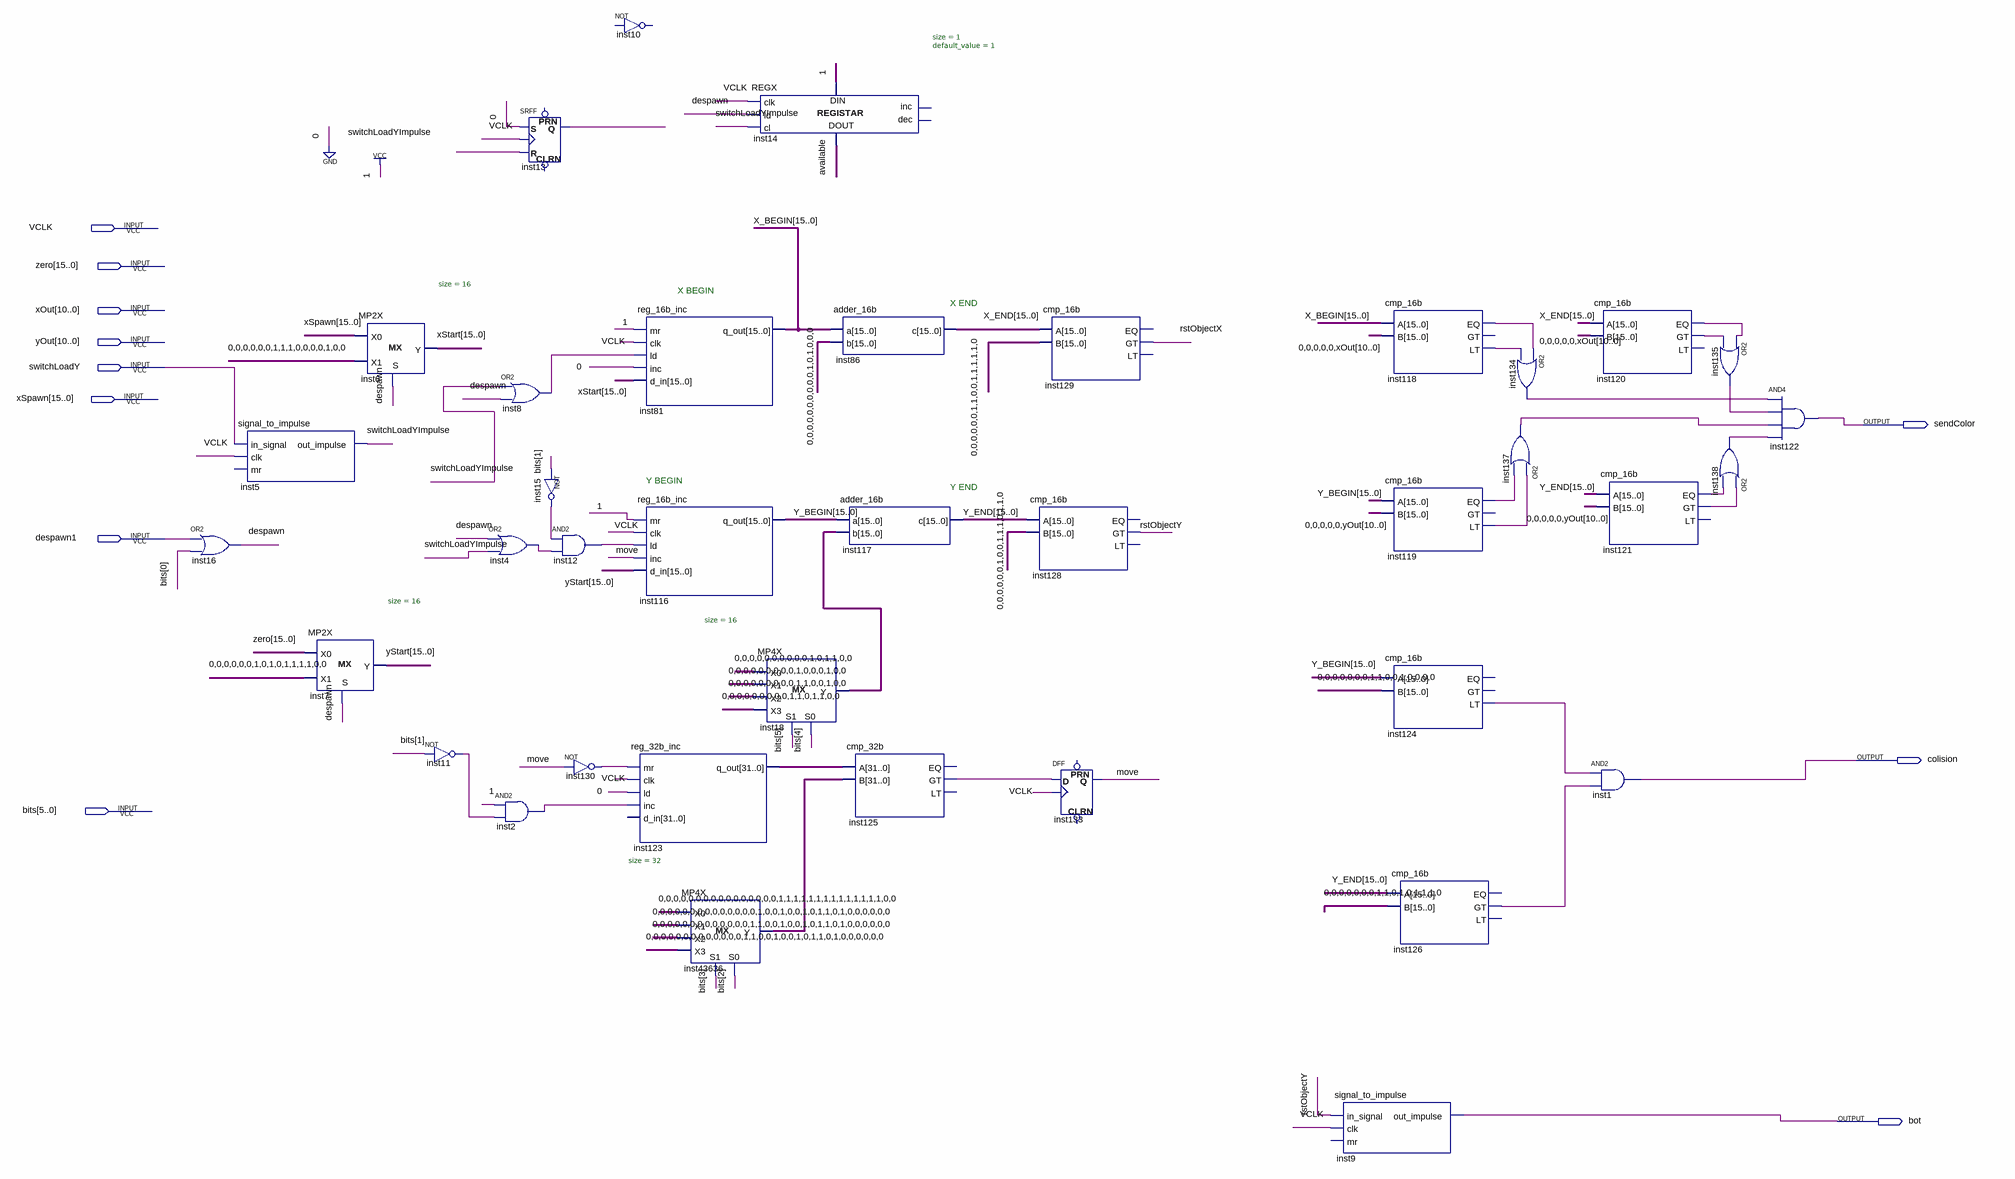
[diagram p0: schematic sheet]
// Quartus schematic object.bdf as structural Verilog: 38 symbols, 11 pins
module object (
  input  VCLK,
  input  [15:0] zero,
  input  [10:0] xOut,
  input  [10:0] yOut,
  input  switchLoadY,
  input  [15:0] xSpawn,
  input  despawn1,
  input  [5:0] bits,
  output sendColor,
  output colision,
  output bot
);

  wire available, despawn, inst2_out, inst4_out, inst8_out, inst11_out, inst12_out, inst13_q, inst15_out,
       inst118_eq, inst118_lt, inst119_eq, inst119_lt, inst120_eq, inst120_gt, inst121_eq, inst121_gt,
       inst124_lt, inst125_gt, inst126_gt, inst130_out, inst134_out, inst135_out, inst137_out, inst138_out,
       move, rstObjectX, rstObjectY, switchLoadYImpulse;
  wire [15:0] inst18_y, X_BEGIN, X_END, xStart, Y_BEGIN, Y_END, yStart;
  wire [31:0] inst123_q_out, inst43636_y;

  or inst16 (despawn, despawn1, bits[0]);
  signal_to_impulse inst5 (.in_signal(switchLoadY), .clk(VCLK), .out_impulse(switchLoadYImpulse));  // open: mr
  MP2X #(.size(16)) inst7 (.S(despawn), .X0(zero), .X1(16'b0000001010111100), .Y(yStart));
  MP2X #(.size(16)) inst6 (.S(despawn), .X0(xSpawn), .X1(16'b0000001110000100), .Y(xStart));
  not inst11 (inst11_out, bits[1]);
  or inst8 (inst8_out, switchLoadYImpulse, despawn);
  or inst4 (inst4_out, despawn, switchLoadYImpulse);
  and inst2 (inst2_out, 1'b1, inst11_out);
  SRFF inst13 (.S(1'b0), .R(switchLoadYImpulse), .CLK(VCLK), .Q(inst13_q));  // open: PRN, CLRN
  not inst15 (inst15_out, bits[1]);
  and inst12 (inst12_out, inst15_out, inst4_out);
  not inst130 (inst130_out, move);
  // NOT inst10 is placed but not wired
  reg_16b_inc inst81 (.mr(1'b1), .clk(VCLK), .ld(inst8_out), .inc(1'b0), .d_in(xStart), .q_out(X_BEGIN));
  reg_16b_inc inst116 (.mr(1'b1), .clk(VCLK), .ld(inst12_out), .inc(move), .d_in(yStart), .q_out(Y_BEGIN));
  reg_32b_inc inst123 (.mr(inst130_out), .clk(VCLK), .ld(1'b0), .inc(inst2_out), .q_out(inst123_q_out));  // open: d_in
  MP4X #(.size(32)) inst43636 (
    .S0(bits[2]), .S1(bits[3]), .X0(32'b00000000000000001111111111111100),
    .X1(32'b00000000000000100100101101000000), .X2(32'b00000000000001100100101101000000),
    .X3(32'b00000000000001100100101101000000), .Y(inst43636_y));
  REGX #(.size(1), .default_value(1)) inst14 (
    .clk(VCLK), .ld(despawn), .cl(switchLoadYImpulse), .data_in(1'b1), .data_out(available));  // open: inc, dec
  MP4X #(.size(16)) inst18 (
    .S0(bits[4]), .S1(bits[5]), .X0(16'b0000000000101100), .X1(16'b0000000001000100),
    .X2(16'b0000000001100100), .X3(16'b0000000001101100), .Y(inst18_y));
  adder_16b inst86 (.a(X_BEGIN), .b(16'b0000000000101000), .c(X_END));
  adder_16b inst117 (.a(Y_BEGIN), .b(inst18_y), .c(Y_END));
  cmp_32b inst125 (.A(inst123_q_out), .B(inst43636_y), .GT(inst125_gt));  // open: EQ, LT
  cmp_16b inst129 (.A(X_END), .B(16'b0000001100111110), .GT(rstObjectX));  // open: EQ, LT
  cmp_16b inst128 (.A(Y_END), .B(16'b0000001001110110), .GT(rstObjectY));  // open: EQ, LT
  DFF inst133 (.CLK(VCLK), .D(inst125_gt), .Q(move));  // open: CLRN, PRN
  signal_to_impulse inst9 (.in_signal(rstObjectY), .clk(VCLK), .out_impulse(bot));  // open: mr
  cmp_16b inst118 (.A(X_BEGIN), .B({{5{1'b0}}, xOut}), .EQ(inst118_eq), .LT(inst118_lt));  // open: GT
  cmp_16b inst119 (.A(Y_BEGIN), .B({{5{1'b0}}, yOut}), .EQ(inst119_eq), .LT(inst119_lt));  // open: GT
  cmp_16b inst124 (.A(Y_BEGIN), .B(16'b0000000110010000), .LT(inst124_lt));  // open: EQ, GT
  cmp_16b inst126 (.A(Y_END), .B(16'b0000000110101110), .GT(inst126_gt));  // open: EQ, LT
  or inst134 (inst134_out, inst118_eq, inst118_lt);
  or inst137 (inst137_out, inst119_lt, inst119_eq);
  cmp_16b inst120 (.A(X_END), .B({{5{1'b0}}, xOut}), .EQ(inst120_eq), .GT(inst120_gt));  // open: LT
  cmp_16b inst121 (.A(Y_END), .B({{5{1'b0}}, yOut}), .EQ(inst121_eq), .GT(inst121_gt));  // open: LT
  and inst1 (colision, inst124_lt, inst126_gt);
  or inst135 (inst135_out, inst120_eq, inst120_gt);
  or inst138 (inst138_out, inst121_gt, inst121_eq);
  and inst122 (sendColor, inst134_out, inst135_out, inst137_out, inst138_out);

  // Notes on the sheet:
  //   X BEGIN
  //   X END
  //   Y BEGIN
  //   Y END
endmodule
